# Altium schematic sheet Part I.SchDoc
size A4; SheetNumber: 4; SheetTotal: 16
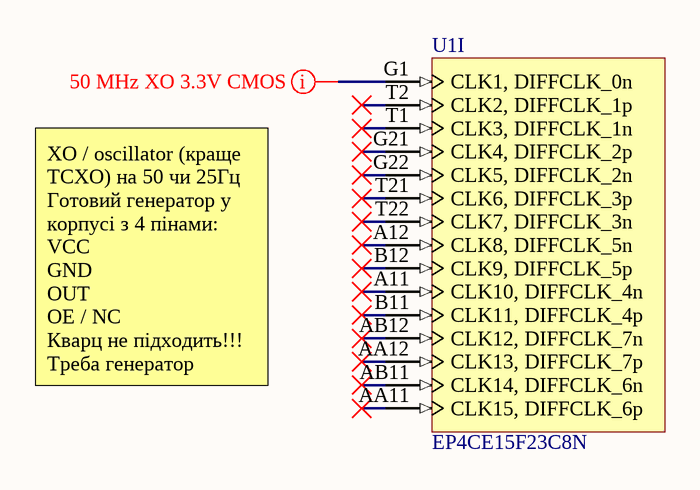
[diagram p0: Part I.SchDoc]

## Parts
U1  EP4CE15F23C8N  [FBGA484_A-240]  (part I of 13)

## Nets

Not connected (* = marked no-connect by the designer): U1 A11(CLK10,_DIFFCLK_4n)* A12(CLK8,_DIFFCLK_5n)* AA11(CLK15,_DIFFCLK_6p)* AA12(CLK13,_DIFFCLK_7p)* AB11(CLK14,_DIFFCLK_6n)* AB12(CLK12,_DIFFCLK_7n)* B11(CLK11,_DIFFCLK_4p)* B12(CLK9,_DIFFCLK_5p)* G1(CLK1,_DIFFCLK_0n) G21(CLK4,_DIFFCLK_2p)* G22(CLK5,_DIFFCLK_2n)* T1(CLK3,_DIFFCLK_1n)* T2(CLK2,_DIFFCLK_1p)* T21(CLK6,_DIFFCLK_3p)* T22(CLK7,_DIFFCLK_3n)*

## Layout directives
mark named 50 MHz XO 3.3V CMOS: NetU1_G1

## Notes on the sheet
- XO / oscillator (краще TCXO) на 50 чи 25Гц
  Готовий генератор у корпусі з 4 пінами:
  VCC
  GND
  OUT
  OE / NC
  Кварц не підходить!!! Треба генератор

## Library data of the parts
U1 = FPGA_EP4CE15F23C8N: Cyclone IV Family FPGA, 1.2V Core, 343 I/O Pins, 4 PLLs, 484-Pin FBGA, Speed Grade 8, Commercial Grade, Pb-Free; Manufacturer: Altera; PackageVersion: ver1.0, Jun-2011; PackageReference: FBGA484_A-240; ComponentLink3URL: http://www.altera.com/literature/lit-dp.jsp?category=cyc%204&showspreadsheet=y; ComponentLink1Description: Manufacturer URL; DatasheetVersion: ver1.6, Nov-2011; ComponentLink3Description: Pinout; ComponentLink2URL: http://www.altera.com/literature/hb/cyclone-iv/cyclone4-handbook.pdf; ComponentLink1URL: http://www.altera.com/; ComponentLink2Description: Handbook; PackageDescription: 484-Pin FineLine Ball Grid Array (FBGA) - Wire Bond - A:2.40; Code_JEDEC: MS-034-AAJ-1; ComponentLink4URL: http://www.altera.com/devicepackaging/04R00247-02.pdf; ComponentLink4Description: Package Specification